# EAGLE design controller connectors (EAGLE 9.6.2)
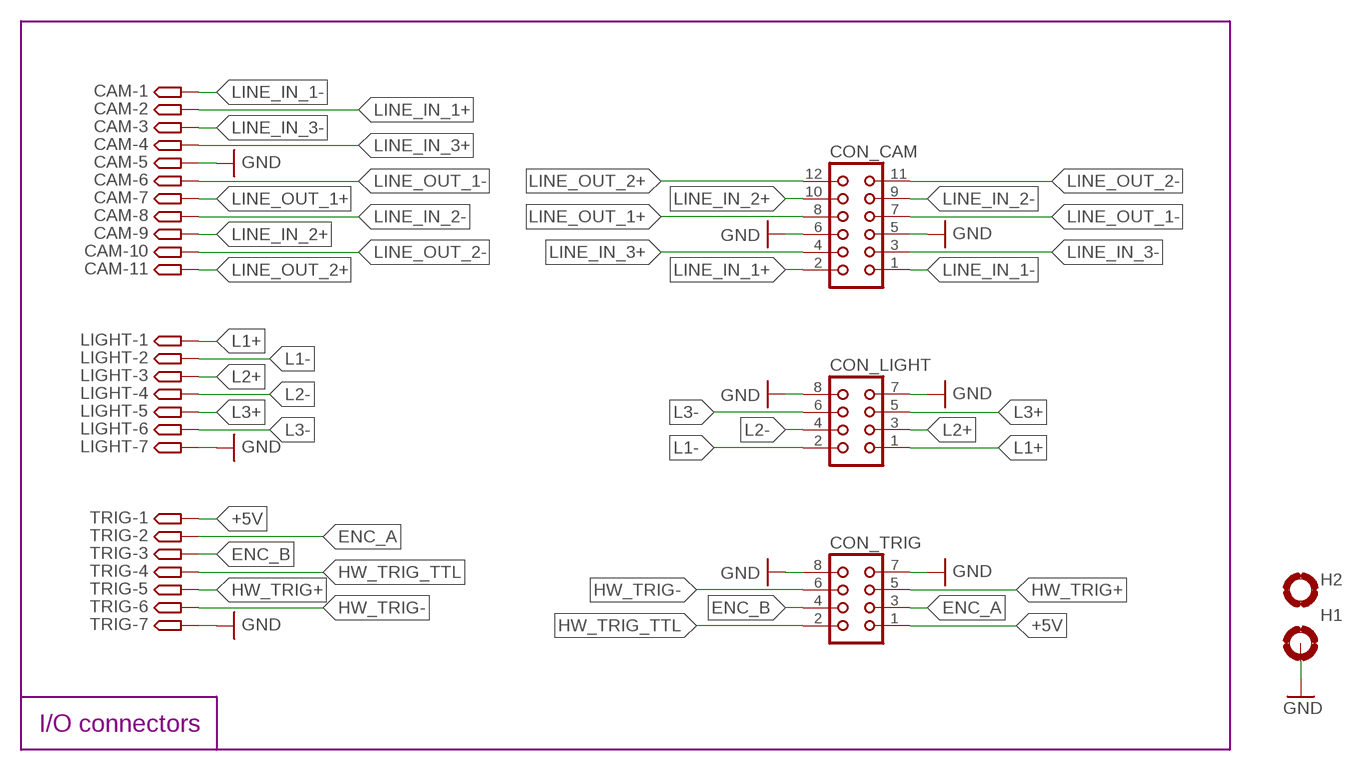
[diagram p0: schematic, sheet 1]

## Parts
CAM  SMPAD-11  [S-11P]
CON_CAM  CON12  [CON12_2MM]
CON_LIGHT  CON8  [CON8_2MM]
CON_TRIG  CON8  [CON8_2MM]
H1  HOLE-3MM_PLATED  [3MM_PLATED]
H2  HOLE_UNPLATED  [3MM_UNPLATED_1SIDE]
LIGHT  SMPAD-7  [S-7P]
TRIG  SMPAD-7  [S-7P]

## Nets
+5V: CON_TRIG.1 TRIG.1
ENC_A: CON_TRIG.3 TRIG.2
ENC_B: CON_TRIG.4 TRIG.3
GND: CAM.5 CON_CAM.5 CON_CAM.6 CON_LIGHT.7 CON_LIGHT.8 CON_TRIG.7 CON_TRIG.8 H1.1(MOUNT) LIGHT.7 TRIG.7
HW_TRIG+: CON_TRIG.5 TRIG.5
HW_TRIG-: CON_TRIG.6 TRIG.6
HW_TRIG_TTL: CON_TRIG.2 TRIG.4
L1+: CON_LIGHT.1 LIGHT.1
L1-: CON_LIGHT.2 LIGHT.2
L2+: CON_LIGHT.3 LIGHT.3
L2-: CON_LIGHT.4 LIGHT.4
L3+: CON_LIGHT.5 LIGHT.5
L3-: CON_LIGHT.6 LIGHT.6
LINE_IN_1+: CAM.2 CON_CAM.2
LINE_IN_1-: CAM.1 CON_CAM.1
LINE_IN_2+: CAM.9 CON_CAM.10
LINE_IN_2-: CAM.8 CON_CAM.9
LINE_IN_3+: CAM.4 CON_CAM.4
LINE_IN_3-: CAM.3 CON_CAM.3
LINE_OUT_1+: CAM.7 CON_CAM.8
LINE_OUT_1-: CAM.6 CON_CAM.7
LINE_OUT_2+: CAM.11 CON_CAM.12
LINE_OUT_2-: CAM.10 CON_CAM.11

## Notes on the sheet
- I/O connectors

## Library data of the parts
CAM = custom connectors:SMPAD-11
CON_CAM = custom connectors:CON12: CONNECTOR
CON_LIGHT CON_TRIG = custom connectors:CON8: CONNECTOR; OC_FARNELL: unknown; OC_NEWARK: unknown
H1 = custom mounting:HOLE
H2 = custom mounting:HOLE_UNPLATED
LIGHT TRIG = custom connectors:SMPAD-7

## Board
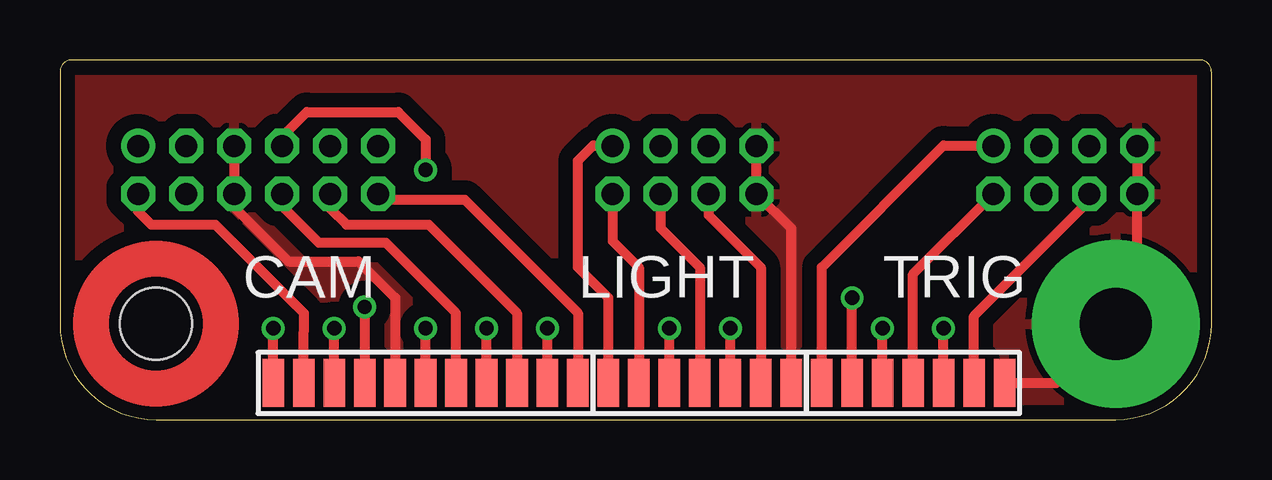
[diagram p1: board, top side]
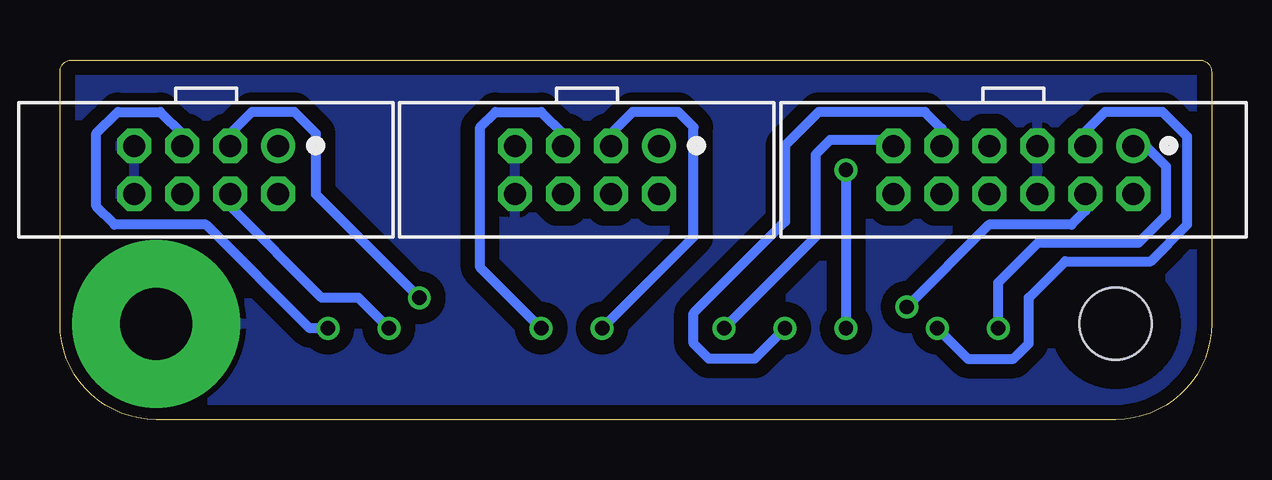
[diagram p2: board, bottom side, seen from below]

Size 48 x 15 mm. Coordinates in mm from the lower left corner, seen from the top.
Outline: 48,4 48,14.5 arc90 47.5,15 0.5,15 arc90 0,14.5 0,4 arc90 4,0 44,0 arc90 48,4
Copper layers (1*16): Top 0.035mm / dielectric 1.5mm / Bottom 0.035mm
Design rules "JLCPCB": minimum track width 8mil, minimum drill 0.3mm, track to track 8mil, track to pad 8mil, pad to pad 8mil, via to via 10mil, smd to smd 6mil, copper to edge 16mil, drill to drill 22mil, minimum pad ring 10mil, minimum via ring 7mil, stop-mask expansion 4mil, vias tented up to drill 1000mil, thermal gap 10mil

### Footprints (pad centres in the part's own frame; a part is rotated, then mirrored left to right if it is on the bottom)
S-11P = smd 0.9 x 2: 1 -6.35,0; 2 -5.08,0; 3 -3.81,0; 4 -2.54,0; 5 -1.27,0; 6 0,0; 7 1.27,0; 8 2.54,0; 9 3.81,0; 10 5.08,0; 11 6.35,0
CON12_2MM = drill 0.914: 1 -5,-1 | drill 0.914 octagon: 2 -5,1; 3 -3,-1; 4 -3,1; 5 -1,-1; 6 -1,1; 7 1,-1; 8 1,1; 9 3,-1; 10 3,1; 11 5,-1; 12 5,1
CON8_2MM = drill 0.914: 1 -3,-1 | drill 0.914 octagon: 2 -3,1; 3 -1,-1; 4 -1,1; 5 1,-1; 6 1,1; 7 3,-1; 8 3,1
3MM_PLATED = drill 3 pad 7: 1 0,0
3MM_UNPLATED_1SIDE = hole 3: 0,0
S-7P = smd 0.9 x 2: 1 -3.81,0; 2 -2.54,0; 3 -1.27,0; 4 0,0; 5 1.27,0; 6 2.54,0; 7 3.81,0

### Placement (x,y rotation side)
CAM  15.24,1.52 0 top
CON_CAM  8.26,10.41 180 bottom
CON_LIGHT  26.04,10.41 180 bottom
CON_TRIG  41.91,10.41 180 bottom
H1  44,4 0 top
H2  4,4 0 top
LIGHT  26.67,1.52 0 top
TRIG  35.56,1.52 0 top

### Tracks (layer width: path | path; a pad name or v marks a point on that pad's centre or on a via)
+5V
  Top 0.406: TRIG.1 31.75,6.35 36.83,11.43 38.89,11.43 CON_TRIG.1
ENC_A  (via drill 0.6)
  Top 0.406: TRIG.2 v33.02,5.08
  Bottom 0.406: v33.02,5.08 37.34,9.4 37.34,11.94 38.23,12.83 40.01,12.83 40.91,11.92 CON_TRIG.3
ENC_B  (via drill 0.6)
  Top 0.406: TRIG.3 v34.29,3.81
  Bottom 0.406: v34.29,3.81 35.56,5.08 37.08,5.08 40.91,8.91 CON_TRIG.4
GND
  Top 0.406: LIGHT.7 30.48,7.97 CON_LIGHT.8 CON_LIGHT.7 | TRIG.7 41.52,1.52 H1.1 44.91,4.91 CON_TRIG.8 CON_TRIG.7 | CON_CAM.5 CON_CAM.6 7.25,8.87 9.53,6.6 12.45,6.6 13.97,5.08 CAM.5
  pour Top (isolate 0.61): -1.27,16.51 49.53,16.51 49.53,-1.27 -1.27,-1.27
  pour Bottom (isolate 0.61): -2.54,17.78 50.8,17.78 50.8,-2.54 -2.54,-2.54
HW_TRIG+  (via drill 0.6)
  Top 0.406: TRIG.5 v36.83,3.81
  Bottom 0.406: v36.83,3.81 37.59,3.81 41.91,8.13 45.72,8.13 46.48,8.89 46.48,11.94 45.59,12.83 43.81,12.83 42.91,11.92 CON_TRIG.5
HW_TRIG-
  Top 0.406: CON_TRIG.6 42.91,9.13 38.1,4.32 TRIG.6
HW_TRIG_TTL
  Top 0.406: TRIG.4 35.56,6.06 CON_TRIG.2
L1+
  Top 0.406: LIGHT.1 22.86,5.08 21.59,6.35 21.59,10.79 22.23,11.43 23.02,11.43 CON_LIGHT.1
L1-
  Top 0.406: CON_LIGHT.2 23.04,7.45 24.13,6.35 LIGHT.2
L2+  (via drill 0.6)
  Top 0.406: LIGHT.3 v25.4,3.81
  Bottom 0.406: v25.4,3.81 21.59,7.62 21.59,12.19 22.23,12.83 24.13,12.83 25.04,11.92 CON_LIGHT.3
L2-
  Top 0.406: CON_LIGHT.4 25.04,7.99 26.67,6.35 LIGHT.4
L3+  (via drill 0.6)
  Top 0.406: LIGHT.5 v27.94,3.81
  Bottom 0.406: v27.94,3.81 30.48,6.35 30.48,12.19 29.84,12.83 27.94,12.83 27.04,11.92 CON_LIGHT.5
L3-
  Top 0.406: CON_LIGHT.6 27.04,8.53 29.21,6.35 LIGHT.6
LINE_IN_1+
  Top 0.406: CAM.2 10.16,3.68 10.16,4.45 6.48,8.13 3.81,8.13 3.25,8.68 CON_CAM.2
LINE_IN_1-  (via drill 0.6)
  Top 0.406: CAM.1 v8.89,3.81
  Bottom 0.406: v8.89,3.81 8.89,5.71 7.24,7.37 3.05,7.37 1.91,8.51 1.91,10.57 2.75,11.41 CON_CAM.1
LINE_IN_2+
  Top 0.406: CAM.9 19.05,4.45 15.37,8.13 11.94,8.13 11.26,8.81 CON_CAM.10
LINE_IN_2-  (via drill 0.6)
  Top 0.406: CAM.8 v17.78,3.81
  Bottom 0.406: v17.78,3.81 19.05,2.54 20.95,2.54 21.59,3.17 21.59,4.45 17.78,8.26 17.78,11.43 16.38,12.83 11.94,12.83 11.26,12.14 CON_CAM.9
LINE_IN_3+  (via drill 0.6)
  Top 0.406: v12.7,4.7 CAM.4
  Bottom 0.406: CON_CAM.4 5.25,8.71 5.84,8.13 9.27,8.13 v12.7,4.7
LINE_IN_3-  (via drill 0.6)
  Top 0.406: CAM.3 v11.43,3.81
  Bottom 0.406: v11.43,3.81 10.16,2.54 8.26,2.54 7.62,3.17 7.62,5.08 6.1,6.6 2.54,6.6 1.02,8.13 1.02,11.81 2.03,12.83 4.45,12.83 5.25,12.02 CON_CAM.3
LINE_OUT_1+
  Top 0.406: CAM.7 16.51,4.45 13.59,7.37 10.79,7.37 9.26,8.91 CON_CAM.8
LINE_OUT_1-  (via drill 0.6)
  Top 0.406: CON_CAM.7 9.26,11.79 10.29,12.83 14.1,12.83 15.24,11.68 v15.24,10.41 | CAM.6 v15.24,3.81
  Bottom 0.406: v15.24,10.41 v15.24,3.81
LINE_OUT_2+
  Top 0.406: CON_CAM.12 13.51,9.16 16.88,9.16 21.59,4.45 CAM.11
LINE_OUT_2-  (via drill 0.6)
  Top 0.406: CAM.10 v20.32,3.81
  Bottom 0.406: CON_CAM.11 13.51,11.67 15.89,11.67 16.51,11.05 16.51,7.62 v20.32,3.81